# EAGLE design cellsaver (EAGLE 7.7.0)
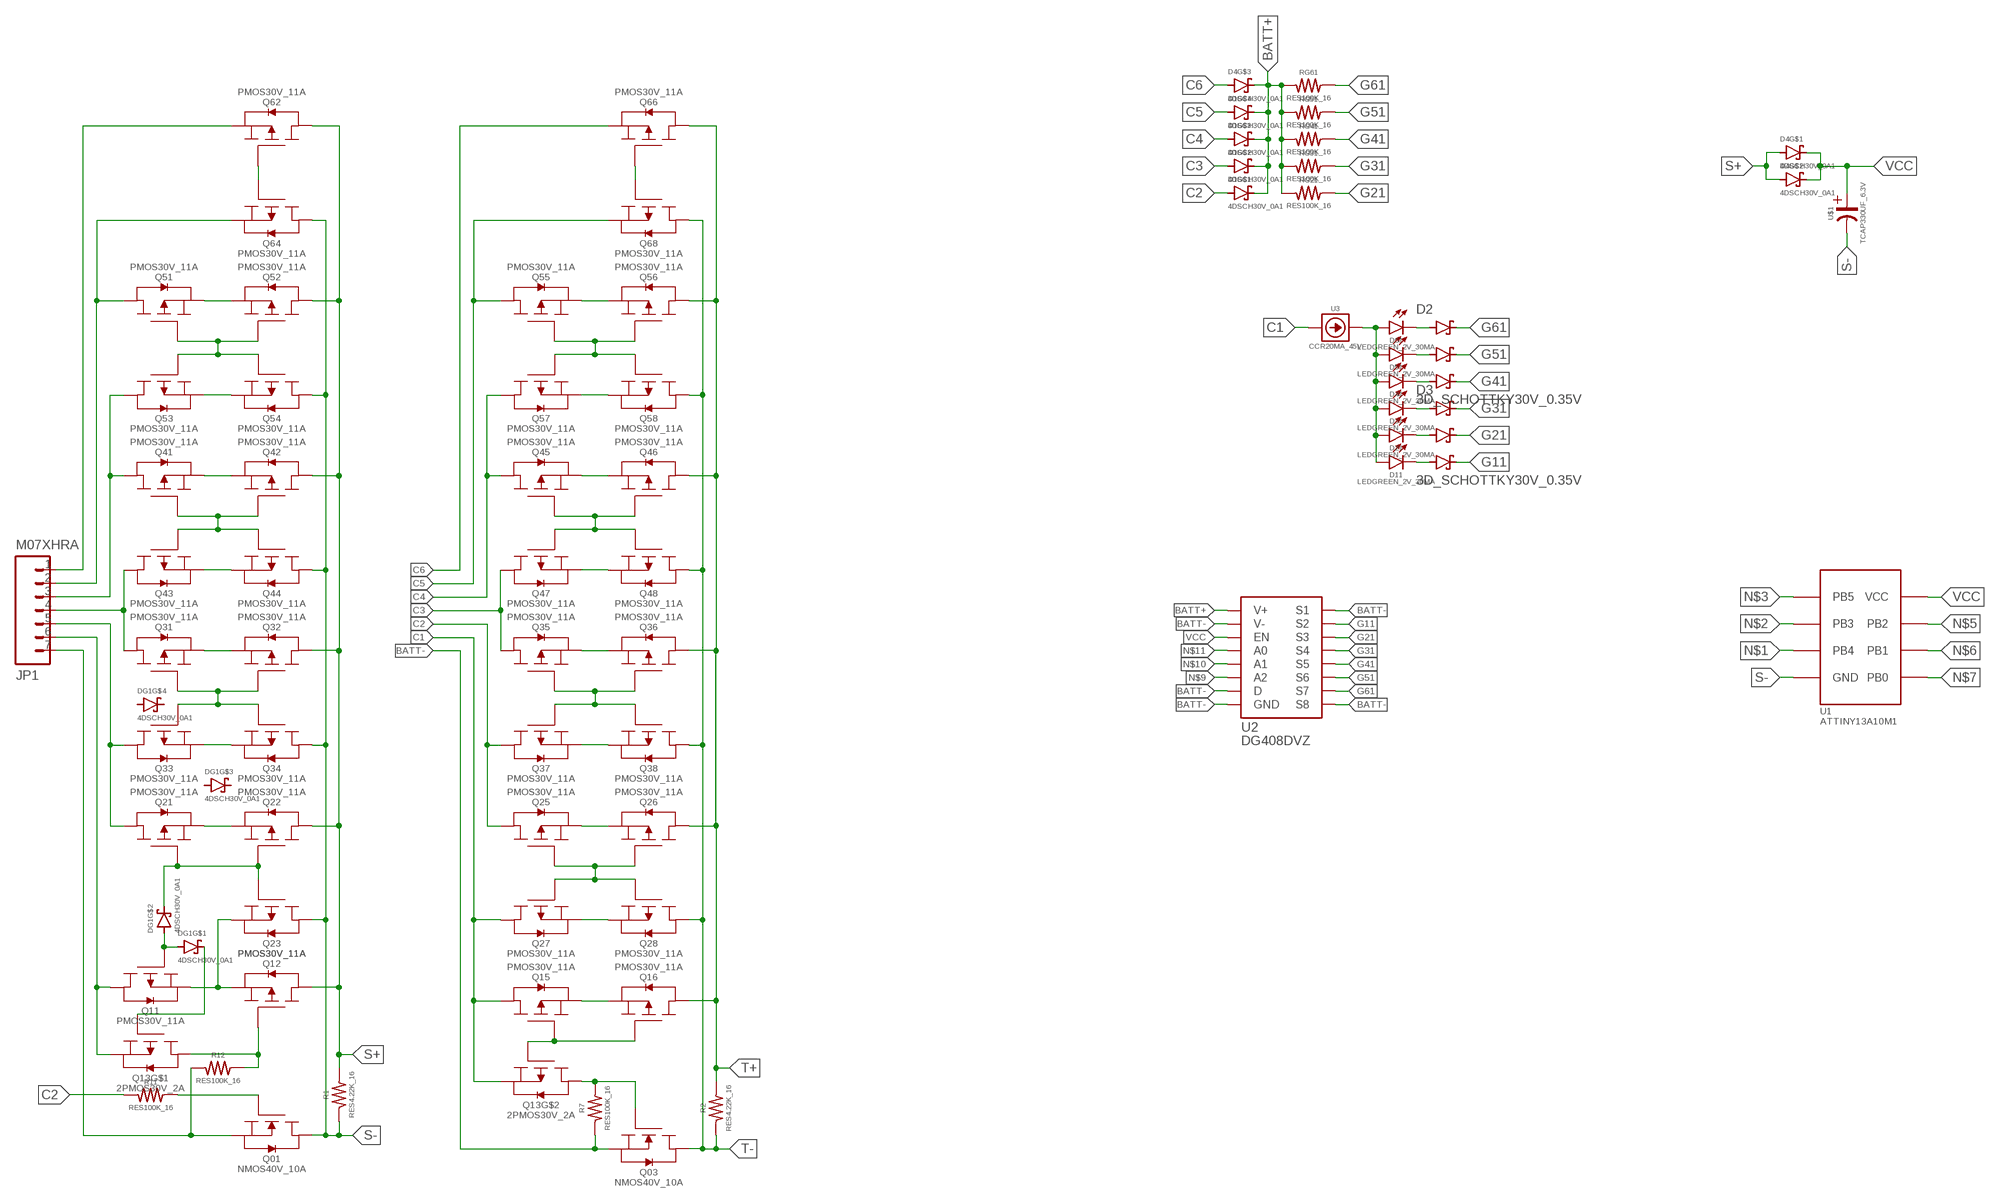
[diagram p0: schematic, sheet 1]

## Parts
D1  4DSCH30V_0A1  [8-HMD]
D2  3D_SCHOTTKY30V_0.35V  [SOT-363]
D3  3D_SCHOTTKY30V_0.35V  [SOT-363]
D4  4DSCH30V_0A1  [8-HMD]
D11  LEDGREEN_2V_30MA  [0603+]
D21  LEDGREEN_2V_30MA  [0603+]
D31  LEDGREEN_2V_30MA  [0603+]
D41  LEDGREEN_2V_30MA  [0603+]
D51  LEDGREEN_2V_30MA  [0603+]
D61  LEDGREEN_2V_30MA  [0603+]
DG1  4DSCH30V_0A1  [8-HMD]
JP1  M07XHRA  [XH07-RA]
Q01  NMOS40V_10A  [6-POWERWDFN]
Q03  NMOS40V_10A  [6-POWERWDFN]
Q11  PMOS30V_11A  [6-POWERWDFN]
Q12  PMOS30V_11A  [6-POWERWDFN]
Q13  2PMOS30V_2A  [6-TSOP]
Q15  PMOS30V_11A  [6-POWERWDFN]
Q16  PMOS30V_11A  [6-POWERWDFN]
Q21  PMOS30V_11A  [6-POWERWDFN]
Q22  PMOS30V_11A  [6-POWERWDFN]
Q23  PMOS30V_11A  [6-POWERWDFN]
Q25  PMOS30V_11A  [6-POWERWDFN]
Q26  PMOS30V_11A  [6-POWERWDFN]
Q27  PMOS30V_11A  [6-POWERWDFN]
Q28  PMOS30V_11A  [6-POWERWDFN]
Q31  PMOS30V_11A  [6-POWERWDFN]
Q32  PMOS30V_11A  [6-POWERWDFN]
Q33  PMOS30V_11A  [6-POWERWDFN]
Q34  PMOS30V_11A  [6-POWERWDFN]
Q35  PMOS30V_11A  [6-POWERWDFN]
Q36  PMOS30V_11A  [6-POWERWDFN]
Q37  PMOS30V_11A  [6-POWERWDFN]
Q38  PMOS30V_11A  [6-POWERWDFN]
Q41  PMOS30V_11A  [6-POWERWDFN]
Q42  PMOS30V_11A  [6-POWERWDFN]
Q43  PMOS30V_11A  [6-POWERWDFN]
Q44  PMOS30V_11A  [6-POWERWDFN]
Q45  PMOS30V_11A  [6-POWERWDFN]
Q46  PMOS30V_11A  [6-POWERWDFN]
Q47  PMOS30V_11A  [6-POWERWDFN]
Q48  PMOS30V_11A  [6-POWERWDFN]
Q51  PMOS30V_11A  [6-POWERWDFN]
Q52  PMOS30V_11A  [6-POWERWDFN]
Q53  PMOS30V_11A  [6-POWERWDFN]
Q54  PMOS30V_11A  [6-POWERWDFN]
Q55  PMOS30V_11A  [6-POWERWDFN]
Q56  PMOS30V_11A  [6-POWERWDFN]
Q57  PMOS30V_11A  [6-POWERWDFN]
Q58  PMOS30V_11A  [6-POWERWDFN]
Q62  PMOS30V_11A  [6-POWERWDFN]
Q64  PMOS30V_11A  [6-POWERWDFN]
Q66  PMOS30V_11A  [6-POWERWDFN]
Q68  PMOS30V_11A  [6-POWERWDFN]
R1  RES4.22K_16  [0402]
R2  RES4.22K_16  [0402]
R7  RES100K_16  [0402]
R11  RES100K_16  [0402]
R12  RES100K_16  [0402]
RG21  RES100K_16  [0402]
RG31  RES100K_16  [0402]
RG41  RES100K_16  [0402]
RG51  RES100K_16  [0402]
RG61  RES100K_16  [0402]
U1  ATTINY13A10M1  [10-MLF]
U2  DG408DVZ  [16-TSSOP]
U3  CCR20MA_45V  [SOD-123]
U$1  TCAP330UF_6.3V  [1210+]

## Nets
BATT+: D1.5(C) D1.6(C) D1.7(C) D1.8(C) D4.6(C) RG21.1 RG31.1 RG41.1 RG51.1 RG61.1 U2.13(V+)
BATT-: JP1.7 Q01.S Q03.S R7.1 R12.1 U2.4(S1)
C1: JP1.6 Q11.D Q13.2(S) Q13.5(S) Q15.D Q27.D U3.A
C2: D1.1(A) JP1.5 Q21.D Q25.D Q33.D Q37.D R11.1
C3: D1.2(A) JP1.4 Q31.D Q35.D Q43.D Q47.D
C4: D1.3(A) JP1.3 Q41.D Q45.D Q53.D Q57.D
C5: D1.4(A) JP1.2 Q51.D Q55.D Q64.S Q68.S
C6: D4.3(A) JP1.1 Q62.S Q66.S
G02: Q03.G Q13.4(D) R7.2
G11: D3.4(C3) DG1.8(C) Q01.G Q13.1(G) R11.2 U2.5(S2)
G13: Q13.3(G) Q15.G Q16.G
G21: D3.5(C2) DG1.7(C) Q21.G Q22.G Q23.G RG21.2 U2.6(S3)
G22: Q25.G Q26.G Q27.G Q28.G
G31: D3.6(C1) Q31.G Q32.G Q33.G Q34.G RG31.2 U2.7(S4)
G32: Q35.G Q36.G Q37.G Q38.G
G41: D2.4(C3) Q41.G Q42.G Q43.G Q44.G RG41.2 U2.12(S5)
G42: Q45.G Q46.G Q47.G Q48.G
G51: D2.5(C2) Q51.G Q52.G Q53.G Q54.G RG51.2 U2.11(S6)
G52: Q55.G Q56.G Q57.G Q58.G
G61: D2.6(C1) Q62.G Q64.G RG61.2 U2.10(S7)
G62: Q66.G Q68.G
N$1: U1.4(PB4)
N$2: U1.2(PB3)
N$3: U1.1(PB5)
N$4: D11.A D21.A D31.A D41.A D51.A D61.A U3.C
N$5: U1.9(PB2)
N$6: U1.7(PB1)
N$7: U1.6(PB0)
N$8: D2.1(A1) D61.C
N$9: U2.15(A2)
N$10: U2.16(A1)
N$11: U2.1(A0)
N$12: D2.2(A2) D51.C
N$13: D2.3(A3) D41.C
N$14: D3.1(A1) D31.C
N$15: D3.2(A2) D21.C
N$16: D3.3(A3) D11.C
N$17: Q12.G Q13.6(D) R12.2
N$18: DG1.1(A) DG1.2(A) Q11.G
S+: D4.1(A) D4.2(A) Q12.D Q22.D Q32.D Q42.D Q52.D Q62.D R1.2
S+12: Q15.S Q16.S
S+21: Q21.S Q22.S
S+22: Q25.S Q26.S
S+31: Q31.S Q32.S
S+32: Q35.S Q36.S
S+41: Q41.S Q42.S
S+42: Q45.S Q46.S
S+51: Q51.S Q52.S
S+52: Q55.S Q56.S
S-: Q01.D Q23.D Q34.D Q44.D Q54.D Q64.D R1.1 U1.5(GND) U1.11(GND) U$1.C
S-21: Q11.S Q12.S Q23.S
S-22: Q27.S Q28.S
S-31: Q33.S Q34.S
S-32: Q37.S Q38.S
S-41: Q43.S Q44.S
S-42: Q47.S Q48.S
S-51: Q53.S Q54.S
S-52: Q57.S Q58.S
T+: Q16.D Q26.D Q36.D Q46.D Q56.D Q66.D R2.2
T-: Q03.D Q28.D Q38.D Q48.D Q58.D Q68.D R2.1
VCC: D4.7(C) D4.8(C) U1.10(VCC) U2.2(EN) U$1.A
Unconnected: D4.4(A) D4.5(C) DG1.3(A) DG1.4(A) DG1.5(C) DG1.6(C) U2.3(V-) U2.8(D) U2.9(S8) U2.14(GND)

## Library data of the parts
D1 D4 DG1 = dubec:4DSCH: Array of 4 independent Schottky diodes; DIGIKEY_PART_#: RB521ZS8A30TE61CT-ND; EURO: 4.70/10; MANUFACTURER: Rohm Semiconductor; MFG_PART_#: RB521ZS8A30TE61
D2 D3 = dubec:3D_SCHOTTKY: Diode Array 3 Independent Schottky; DIGIKEY_PART_#: BAT54TW-FDICT-ND; EURO: 2.84/10; MANUFACTURER: Diodes Incorporated; MFG_PART_#: BAT54TW-7-F
D11 D21 D31 D41 D51 D61 = dubec:LED: LED; DIGIKEY_PART_#: 160-1435-1-ND; EURO: 3.26/25; LUM: 35mcd; MANUFACTURER: Lite-On Inc.; MFG_PART_#: LTST-C190KGKT
JP1 = dubec:M07; DIGIKEY_PART_#: 455-2240-ND; EURO: 3.82/10; MANUFACTURER: JST Sales America Inc.; MFG_PART_#: S7B-XH-A(LF)(SN)
Q01 Q03 = dubec:NMOS: N-channel MOSFET; DIGIKEY_PART_#: FDMA8051LCT-ND; EURO: 53.34/100; MANUFACTURER: Fairchild Semiconductor; MFG_PART_#: FDMA8051L; POWER: 2.4W; RDS: 14 mOhm @ 10A, 10V
Q11 Q12 Q15 Q16 Q21-Q23 Q25-Q28 Q31-Q38 Q41-Q48 Q51-Q58 Q62 Q64 Q66 Q68 = dubec:PMOS: Single P-Channel MOSFET; DIGIKEY_PART_#: FDMA6676PZCT-ND; EURO: 49.94/100; MANUFACTURER: Fairchild Semiconductor; MFG_PART_#: FDMA6676PZ; POWER: 0.9W; RDS: 13.5 mOhm @ 11A, 10V
Q13 = dubec:2PMOS: Dual P-channel enhancement mode MOSFET; DIGIKEY_PART_#: 785-1466-1-ND; EURO: 8.07/25; MANUFACTURER: Alpha & Omega Semiconductor Inc.; MFG_PART_#: AO6801E; POWER: 0.7W; RDS: 110 mOhm @ 2A, 10V
R1 R2 = dubec:RES: Resistor; DIGIKEY_PART_#: 541-4.22KLCT-ND; MANUFACTURER: Vishay Dale; MFG_PART_#: CRCW04024K22FKED; TEMP: ±100ppm/°C; TOLERANCE: ±1%; USD: 0.78/10
R7 R11 R12 RG21 RG31 RG41 RG51 RG61 = dubec:RES: Resistor; DIGIKEY_PART_#: 541-100KLCT-ND; EURO: 1.17/100; MANUFACTURER: Vishay Dale; MFG_PART_#: CRCW0402100KFKED; TEMP: ±100ppm/°C; TOLERANCE: ±1%
U1 = dubec:ATTINY13A: IC MCU 8BIT 1KB FLASH 10MLF; DIGIKEY_PART_#: ATTINY13A-MMF-ND; MANUFACTURER: Atmel; MFG_PART_#: ATTINY13A-MMF
U2 = dubec:DG408: 8-Channel CMOS Analog Multiplexer; DIGIKEY_PART_#: DG408DVZ-TCT-ND; EUR: 2.52; MANUFACTURER: Intersil; MFG_PART_#: DG408DVZ-T; TEMP: -40°C ~ 85°C (TA)
U3 = dubec:CCR; DIGIKEY_PART_#: NSI45020T1GOSCT-ND; EURO: 3.36/10; MANUFACTURER: ON Semiconductor; MFG_PART_#: NSI45020T1G; TOLERANCE: ±15%
U$1 = dubec:TCAP; DIGIKEY_PART_#: 478-8407-1-ND; ESR: 600mOhm; EURO: 16.56/10; MANUFACTURER: AVX Corporation; MFG_PART_#: F950J337KBAAQ2; TEMP: -55°C ~ 125°C; TOLERANCE: ±10%

## Board
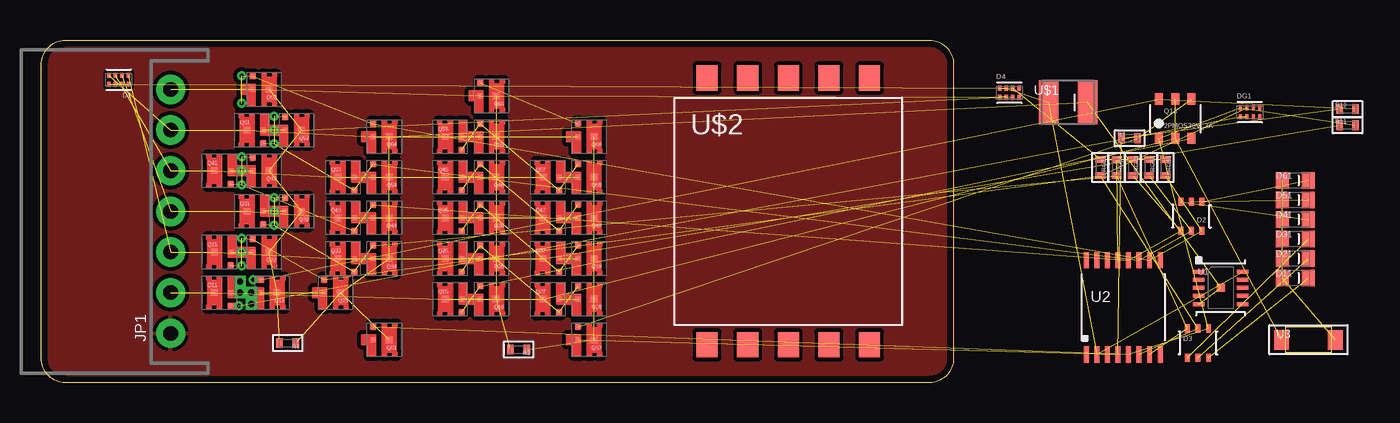
[diagram p1: board, top side]
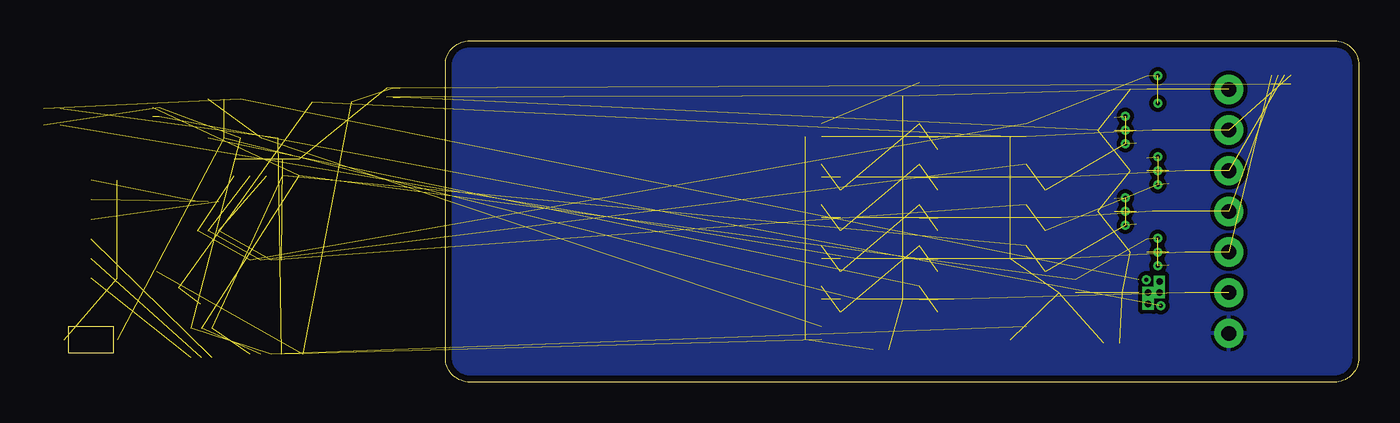
[diagram p2: board, bottom side, seen from below]

Size 56.2 x 21 mm. Coordinates in mm from the lower left corner, seen from the top.
Outline: 0,1.5 arc90 1.5,0 54.7,0 arc90 56.2,1.5 56.2,19.5 arc90 54.7,21 1.5,21 arc90 0,19.5 0,1.5
Copper layers (1+2*15+16): Top 1mil / dielectric 0.2mm / Route2 0.5mil / dielectric 1.2mm / Route15 0.5mil / dielectric 0.2mm / Bottom 1mil
Design rules "default *": minimum track width 0.15mm, minimum drill 0.25mm, track to track 0.15mm, track to pad 0.15mm, pad to pad 0.15mm, via to via 0.15mm, smd to smd 0mil, copper to edge 0.4mm, drill to drill 0.2mm, minimum pad ring 0.15mm, minimum via ring 0.15mm, stop-mask expansion 0.01mm, vias tented up to drill 0.5mm, thermal gap 0.2mm

### Footprints (pad centres in the part's own frame; a part is rotated, then mirrored left to right if it is on the bottom)
8-HMD = smd 0.2 x 0.3: 1 -0.6,-0.275; 2 -0.2,-0.275; 3 0.2,-0.275; 4 0.6,-0.275; 5 0.6,0.275; 6 0.2,0.275; 7 -0.2,0.275; 8 -0.6,0.275
SOT-363 = smd 0.3 x 0.5: 1 -0.65,-0.9; 2 0,-0.9; 3 0.65,-0.9; 4 0.65,0.9; 5 0,0.9; 6 -0.65,0.9
0603+ = smd 0.8 x 1: A -0.8,0; C 0.8,0
XH07-RA = drill 0.9 pad 1.8: 1 7.5,0; 2 5,0; 3 2.5,0; 4 0,0; 5 -2.5,0; 6 -5,0; 7 -7.5,0
6-POWERWDFN = smd 0.4 x 0.4: D -0.3,0 | smd 0.3 x 0.3: G 0.7,-0.8; S 0.7,0
6-TSOP = smd 0.5 x 0.7: 1 -1,-1.2; 2 0,-1.2; 3 1,-1.2; 4 1,1.2; 5 0,1.2; 6 -1,1.2
0402 = smd 0.4 x 0.6: 1 -0.5,0; 2 0.5,0
10-MLF = smd 0.7 x 0.25: 1 -1.35,1; 2 -1.35,0.5; 3 -1.35,0; 4 -1.35,-0.5; 5 -1.35,-1; 6 1.35,-1; 7 1.35,-0.5; 8 1.35,0; 9 1.35,0.5; 10 1.35,1 | smd 0.5 x 0.5: 11 0,0
16-TSSOP = smd 0.3 x 1: 1 -2.275,-2.9; 2 -1.625,-2.9; 3 -0.975,-2.9; 4 -0.325,-2.9; 5 0.325,-2.9; 6 0.975,-2.9; 7 1.625,-2.9; 8 2.275,-2.9; 9 2.275,2.9; 10 1.625,2.9; 11 0.975,2.9; 12 0.325,2.9; 13 -0.325,2.9; 14 -0.975,2.9; 15 -1.625,2.9; 16 -2.275,2.9
SOD-123 = smd 0.9 x 1.2: A -1.65,0; C 1.65,0
1210+ = smd 1.2 x 2.7: A -1.2,0; C 1.2,0
EPQ13 = smd 1.3 x 1.55: 1 -5,-8.2; 2 -2.5,-8.2; 3 0,-8.2; 4 2.5,-8.2; 5 5,-8.2; 6 5,8.2; 7 2.5,8.2; 8 0,8.2; 9 -2.5,8.2; 10 -5,8.2

### Placement (x,y rotation side)
D1  4.8,18.6 180 top
D2  70.8,10.2 180 top  (outside the outline)
D3  71.2,2.4 0 top  (outside the outline)
D4  59.6,17.8 0 top
D11  77.2,6.4 0 top  (outside the outline)
D21  77.2,7.6 0 top  (outside the outline)
D31  77.2,8.8 0 top  (outside the outline)
D41  77.2,10 0 top  (outside the outline)
D51  77.2,11.2 0 top  (outside the outline)
D61  77.2,12.4 0 top  (outside the outline)
DG1  74.4,16.6 0 top  (outside the outline)
JP1  8,10.5 90 top
Q01  21.15,2.6 180 top
Q03  33.75,2.6 180 top
Q11  11,5.5 0 top
Q12  14.25,5.5 180 top
Q13  69.8,16.2 0 top  (outside the outline)
Q15  25.2,5.1 0 top
Q16  27.75,5.1 180 top
Q21  11,8 0 top
Q22  13.75,8 180 top
Q23  18.15,5.5 180 top
Q25  25.2,7.6 0 top
Q26  27.75,7.6 180 top
Q27  31.2,5.1 0 top
Q28  33.75,5.1 180 top
Q31  13,10.5 0 top
Q32  15.75,10.5 180 top
Q33  18.6,7.6 0 top
Q34  21.15,7.6 180 top
Q35  25.2,10.1 0 top
Q36  27.75,10.1 180 top
Q37  31.2,7.6 0 top
Q38  33.75,7.6 180 top
Q41  11,13 0 top
Q42  13.75,13 180 top
Q43  18.6,10.1 0 top
Q44  21.15,10.1 180 top
Q45  25.2,12.6 0 top
Q46  27.75,12.6 180 top
Q47  31.2,10.1 0 top
Q48  33.75,10.1 180 top
Q51  13,15.5 0 top
Q52  15.75,15.5 180 top
Q53  18.6,12.6 0 top
Q54  21.15,12.6 180 top
Q55  25.2,15.1 0 top
Q56  27.75,15.1 180 top
Q57  31.2,12.6 0 top
Q58  33.75,12.6 180 top
Q62  13.75,18 180 top
Q64  21.15,15.1 180 top
Q66  27.75,17.6 180 top
Q68  33.75,15.1 180 top
R1  15.2,2.4 180 top
R2  29.4,2 180 top
R7  67,15 0 top  (outside the outline)
R11  80.4,15.8 0 top  (outside the outline)
R12  80.4,16.8 0 top  (outside the outline)
RG21  65.2,13.2 270 top  (outside the outline)
RG31  66.2,13.2 270 top  (outside the outline)
RG41  67.2,13.2 270 top  (outside the outline)
RG51  68.2,13.2 270 top  (outside the outline)
RG61  69.2,13.2 270 top  (outside the outline)
U1  72.6,5.8 0 top  (outside the outline)
U2  66.6,4.6 0 top  (outside the outline)
U3  78,2.6 0 top  (outside the outline)
U$1  63.2,17.2 0 top  (outside the outline)
U$2  TFORM_4_4311_4A4  [EPQ13]  46,10.5 0 top

### Tracks (layer width: path | path; a pad name or v marks a point on that pad's centre or on a via)
BATT+  (10 unrouted)
BATT-  (3 unrouted)
  pour Top (isolate 0.25): 0,0 0,21.4 56.6,21.4 56.6,0
  pour Bottom (isolate 0.25): 0,0 0,22.2 57.4,22.2 57.4,0
C1  (6 unrouted)
C2  (6 unrouted)
C3  (5 unrouted)
C4  (5 unrouted)
C5  (5 unrouted)
C6  (3 unrouted)
G02  (2 unrouted)
G11  (5 unrouted)
G13  (2 unrouted)
G21  (via drill 0.25)  (8 unrouted)
  other vias: 12.38,7.15 12.38,8.85
G22  (3 unrouted)
G31  (via drill 0.25)  (8 unrouted)
  other vias: 14.38,9.65 14.38,11.35
G32  (3 unrouted)
G41  (via drill 0.25)  (8 unrouted)
  other vias: 12.38,12.15 12.38,13.85
G42  (3 unrouted)
G51  (via drill 0.25)  (8 unrouted)
  other vias: 14.38,14.65 14.38,16.35
G52  (3 unrouted)
G61  (via drill 0.25)  (6 unrouted)
  other vias: 12.38,17.15 12.38,18.85
G62  (1 unrouted)
N$4  (6 unrouted)
N$8  (1 unrouted)
N$12  (1 unrouted)
N$13  (1 unrouted)
N$14  (1 unrouted)
N$15  (1 unrouted)
N$16  (1 unrouted)
N$17  (via drill 0.25)  (2 unrouted)
  Top 0.4: v13.07,6.3 Q12.G
N$18  (via drill 0.25)  (2 unrouted)
  Top 0.4: v12.18,4.7 Q11.G
S+  (8 unrouted)
S+12  (1 unrouted)
S+21  (via drill 0.25)  (2 unrouted)
  other vias: 12.38,8
S+22  (1 unrouted)
S+31  (via drill 0.25)  (2 unrouted)
  other vias: 14.38,10.5
S+32  (1 unrouted)
S+41  (via drill 0.25)  (2 unrouted)
  other vias: 12.38,13
S+42  (1 unrouted)
S+51  (via drill 0.25)  (2 unrouted)
  other vias: 14.38,15.5
S+52  (1 unrouted)
S-  (9 unrouted)
S-21  (via drill 0.4)  (1 unrouted)
  Top 0.3: v12.28,6.2 v12.28,5.5 | v12.28,5.5 v12.97,5.5 | v12.97,5.5 v12.97,4.8 | v12.28,5.5 Q11.S | v12.97,5.5 Q12.S
S-22  (1 unrouted)
S-31  (1 unrouted)
S-32  (1 unrouted)
S-41  (1 unrouted)
S-42  (1 unrouted)
S-51  (1 unrouted)
S-52  (1 unrouted)
T+  (6 unrouted)
T-  (6 unrouted)
VCC  (4 unrouted)